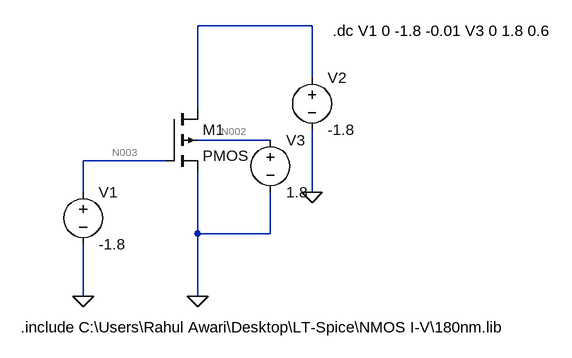
[diagram p0: schematic Draft1.asc]
Draft1.asc, the LTspice schematic file:
Version 4
SHEET 1 880 680
WIRE 416 -16 240 -16
WIRE 416 64 416 -16
WIRE 240 112 240 -16
WIRE 352 160 240 160
WIRE 192 192 64 192
WIRE 64 240 64 192
WIRE 416 240 416 144
WIRE 240 304 240 208
WIRE 352 304 352 240
WIRE 352 304 240 304
WIRE 64 400 64 320
WIRE 240 400 240 304
FLAG 240 400 0
FLAG 64 400 0
FLAG 416 240 0
SYMBOL pmos4 192 112 R0
SYMATTR InstName M1
SYMATTR Value2 l=180nm w=500nm
SYMBOL voltage 64 224 R0
WINDOW 123 0 0 Left 0
WINDOW 39 0 0 Left 0
SYMATTR InstName V1
SYMATTR Value -1.8
SYMBOL voltage 416 48 R0
WINDOW 123 0 0 Left 0
WINDOW 39 0 0 Left 0
SYMATTR InstName V2
SYMATTR Value -1.8
SYMBOL voltage 352 144 R0
WINDOW 123 0 0 Left 0
WINDOW 39 0 0 Left 0
SYMATTR InstName V3
SYMATTR Value 1.8
TEXT -32 448 Left 2 !.include C:\\Users\\Rahul Awari\\Desktop\\LT-Spice\\NMOS I-V\\180nm.lib
TEXT 448 -8 Left 2 !.dc V1 0 -1.8 -0.01 V3 0 1.8 0.6

The netlist it stands for:
* Draft1.asc
M1 N001 N003 0 N002 PMOS l=180nm w=500nm
V1 N003 0 -1.8
V2 N001 0 -1.8
V3 N002 0 1.8
.model NMOS NMOS
.model PMOS PMOS
.lib standard.mos
.include C:\Users\Rahul Awari\Desktop\LT-Spice\NMOS I-V\180nm.lib
.dc V1 0 -1.8 -0.01 V3 0 1.8 0.6
.backanno
.end

* Results of the author's LTspice run, read from the files saved beside the schematic
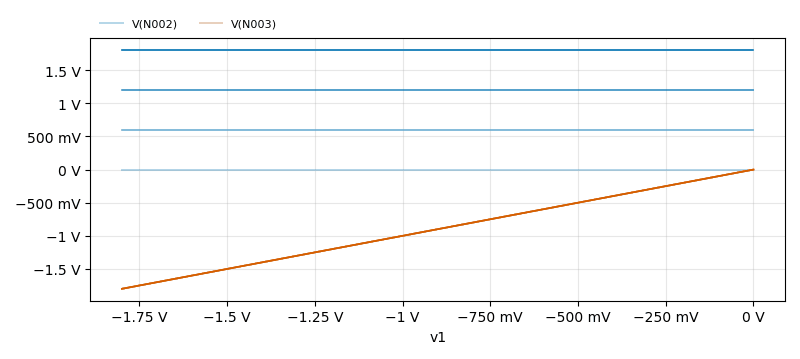
[diagram p1: DC transfer characteristic of Draft1.asc, plotted from the saved traces]
* DC transfer characteristic, 4 runs:
*   V(N002) [v3=0]: 0 V at v1=0 V, 0 V at v1=-1.8 V, min 0 V, max 0 V
*   V(N002) [v3=0.6]: 600 mV at v1=0 V, 600 mV at v1=-1.8 V, min 600 mV, max 600 mV
*   V(N002) [v3=1.2]: 1.2 V at v1=0 V, 1.2 V at v1=-1.8 V, min 1.2 V, max 1.2 V
*   V(N002) [v3=1.8]: 1.8 V at v1=0 V, 1.8 V at v1=-1.8 V, min 1.8 V, max 1.8 V
*   V(N003) [v3=0]: 0 V at v1=0 V, -1.8 V at v1=-1.8 V, min -1.8 V, max 0 V
*   V(N003) [v3=0.6]: 0 V at v1=0 V, -1.8 V at v1=-1.8 V, min -1.8 V, max 0 V
*   V(N003) [v3=1.2]: 0 V at v1=0 V, -1.8 V at v1=-1.8 V, min -1.8 V, max 0 V
*   V(N003) [v3=1.8]: 0 V at v1=0 V, -1.8 V at v1=-1.8 V, min -1.8 V, max 0 V